# EAGLE schematic stacja (EAGLE 9.2.2)
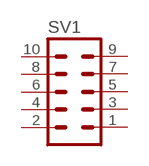
[diagram p0: schematic, sheet 1]

## Parts
SV1  MA05-2  [MA05-2]
Unconnected: SV1.1 SV1.2 SV1.3 SV1.4 SV1.5 SV1.6 SV1.7 SV1.8 SV1.9 SV1.10

## Library data of the parts
SV1 = con-lstb:MA05-2: PIN HEADER; OC_FARNELL: unknown; OC_NEWARK: unknown